# Altium schematic sheet SchmasBLOC.SchDoc
size Tabloid; SheetNumber: 15; SheetTotal: 15; Sheet_Name: Insert name in Document Parameters; Size: 11x17
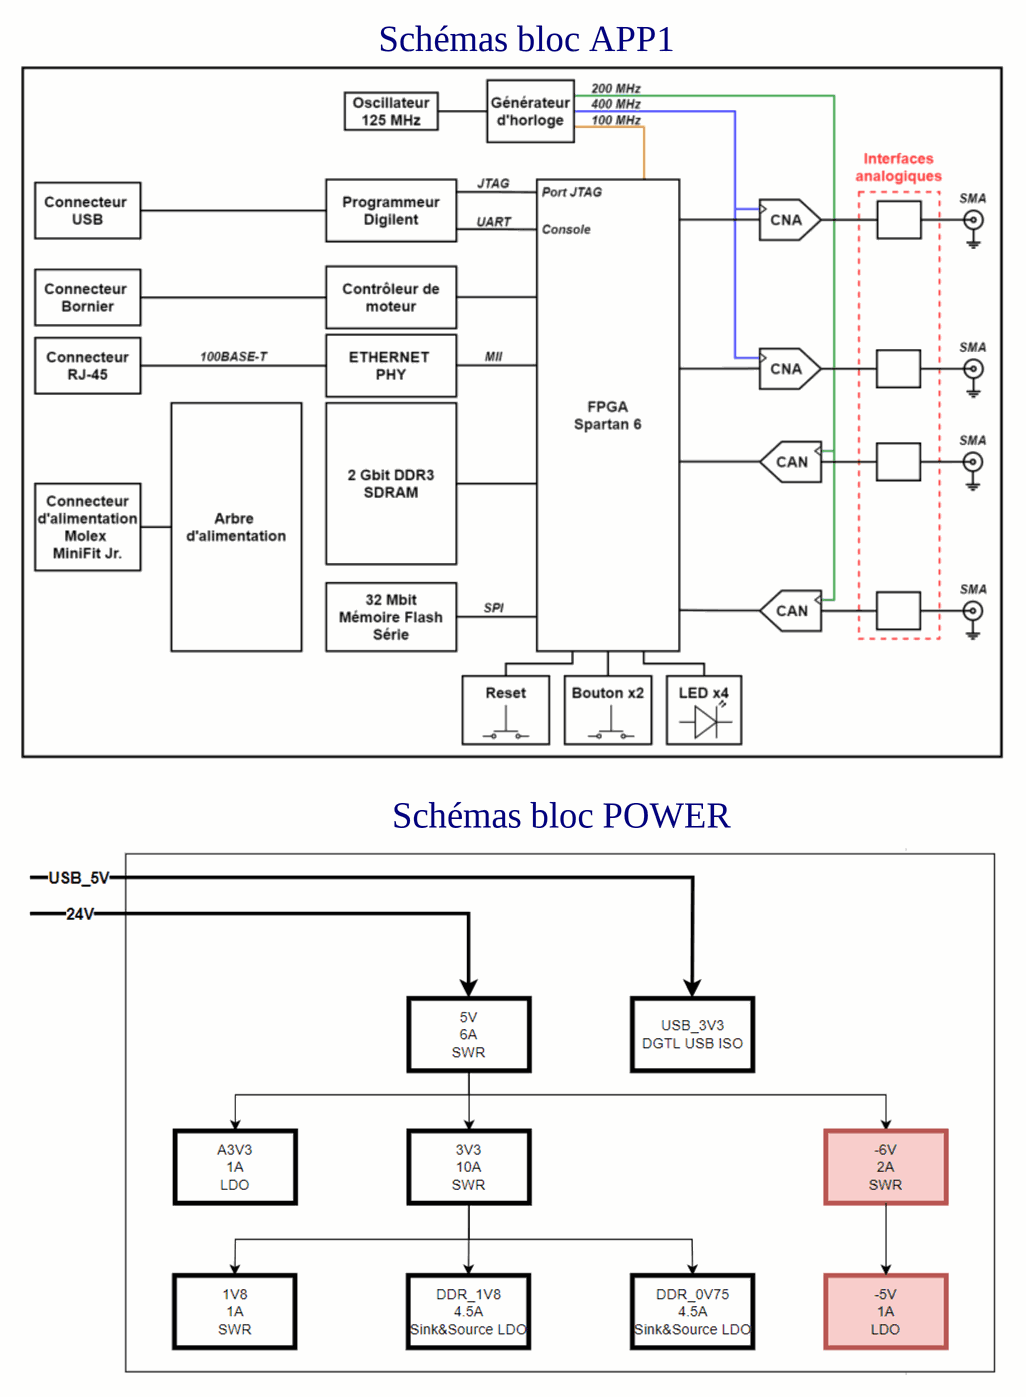
[diagram p0: SchmasBLOC.SchDoc]

## Notes on the sheet
- Schémas bloc APP1
- Schémas bloc POWER
- Sheet Name
- Project Title
- Global Project
- Size
- Group
- Revision
- Date
- Sheet
- of
- Filename
- Designers